# Altium schematic sheet Power Management.SchDoc
size A
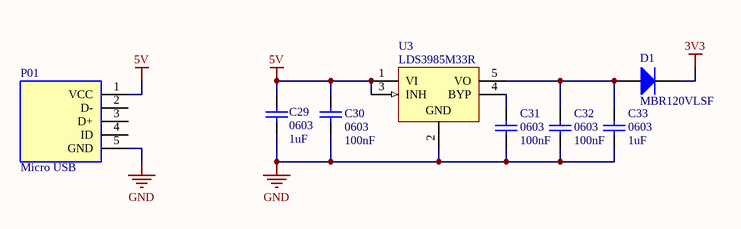
[diagram p0: Power Management.SchDoc]

## Parts
C29  0603  value 1uF  [RAD-0.3]
C30  0603  value 100nF  [RAD-0.3]
C31  0603  value 100nF  [RAD-0.3]
C32  0603  value 100nF  [RAD-0.3]
C33  0603  value 1uF  [RAD-0.3]
D1  MBR120VLSF  [SOD375X160X120-2N]
P01  Micro USB
U3  LDS3985M33R  [SOT23-5L_L]

## Nets
3V3: D1.2(K)
5V: C29.2 C30.2 P01.1(VCC) U3.1(VI) U3.3(INH)
GND: C29.1 C30.1 C31.1 C32.1 C33.1 P01.5(GND) U3.2(GND)
NetC31_2: C31.2 U3.4(BYP)
NetC32_2: C32.2 C33.2 D1.1(A) U3.5(VO)

Not connected (* = marked no-connect by the designer): P01 2(D-) 3(D+) 4(ID)

## Library data of the parts
C29-C33 = Cap: Capacitor; Published: 8-Jun-2000; LatestRevisionDate: 17-Jul-2002; LatestRevisionNote: Re-released for DXP Platform.; PackageReference: RAD-0.3; Publisher: Altium Limited; PackageDescription: Radial Cap, Thru-Hole; 2 Leads; 0.3 in Pin Spacing
D1 = MBR120VLSF: MBR120VLSF Series 20 V 1 A Surface Mount Schottky Power Rectifier - SOD-123FL; Voltage Rating (DC): 20V; Average Rectified Current: 1A; Element Configuration: Single; Forward Voltage: 340mV; Max Forward Surge Current (Ifsm): 45A; Max Reverse Leakage Current: 600uA; Polarity: Standard; Package Quantity: 10000; Lead Free: Lead Free; REACH SVHC: No SVHC; Radiation Hardening: No; Current Rating: 1A; Forward Current: 1A; Halogen Free: Halogen Free; Max Operating Temperature: 125°C; Max Repetitive Reverse Voltage (Vrrm): 20V; Max Reverse Voltage (DC): 20V; Max Surge Current: 45A; Min Operating Temperature: -65°C; Number of Pins: 2; Output Current: 1A; Packaging: Tape and Reel; Peak Non-Repetitive Surge Current: 45A; Peak Reverse Current: 600uA
P01 = CONN_MICRO_USB: General  Micro USB; Manufacture P/N: *
U3 = LDS3985M33R: Ultra Low Drop Low Noise BiCMOS 300 mA Voltage Regulator for use with Very Low ESR Output Capacitor, 3.3V, 5-Pin SOT-23, Tape and Reel; DatasheetVersion: Jul-2010; PackageVersion: 2008; PackageReference: SOT23-5L; PackageDescription: 5-Pin SOT-23 Package, 2.9 x 1.6 mm Body, 0.95 mm Pitch, 2.8 mm Lead Span; PartNumber: LDS3985M33R; ComponentLink1Description: Manufacturer URL; ComponentLink1URL: http://www.st.com; ComponentLink2Description: Datasheet; ComponentLink2URL: http://www.st.com/internet/com/TECHNICAL_RESOURCES/TECHNICAL_LITERATURE/DATASHEET/CD00047465.pdf